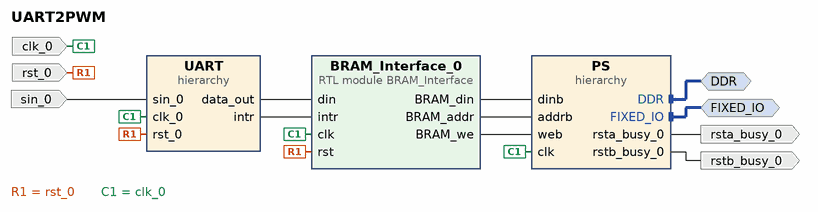
[diagram p0: block diagram of the top level]
# Vivado block design UART2PWM, xc7z020clg400-1, Vivado 2020.2
create_bd_design UART2PWM

create_bd_intf_port -mode Master -vlnv xilinx.com:interface:ddrx_rtl:1.0 DDR
create_bd_intf_port -mode Master -vlnv xilinx.com:display_processing_system7:fixedio_rtl:1.0 FIXED_IO
create_bd_port -dir I -type clk clk_0
set_property -dict {CONFIG.FREQ_HZ 125000000} [get_bd_ports clk_0]
create_bd_port -dir I rst_0
create_bd_port -dir I sin_0
create_bd_port -dir O rsta_busy_0
create_bd_port -dir O rstb_busy_0

create_bd_cell -type hier PS
create_bd_cell -type hier UART
create_bd_cell -type module -reference BRAM_Interface BRAM_Interface_0

# ---- hierarchy /PS ----
current_bd_instance /PS
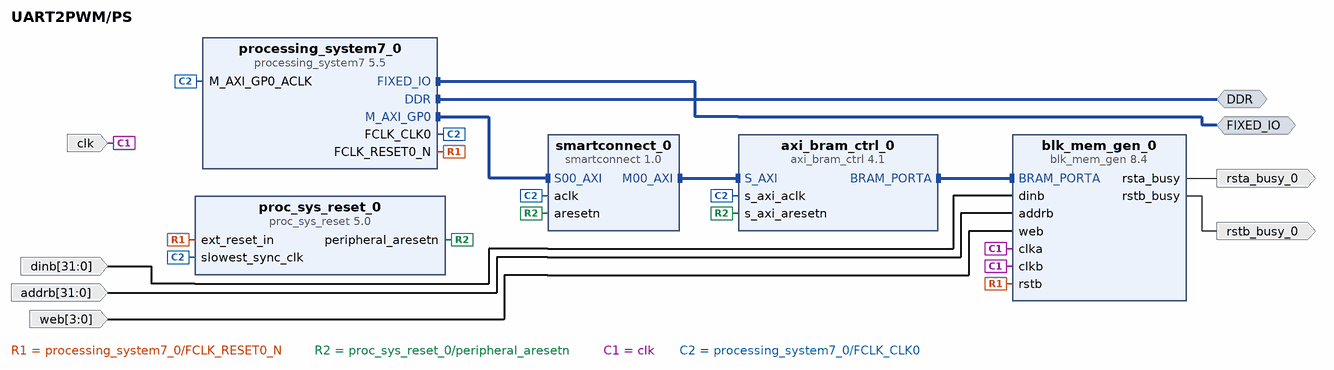
[diagram p1: block diagram inside /PS]
create_bd_intf_pin -mode Master -vlnv xilinx.com:interface:ddrx_rtl:1.0 DDR
create_bd_intf_pin -mode Master -vlnv xilinx.com:display_processing_system7:fixedio_rtl:1.0 FIXED_IO
create_bd_pin -dir O rsta_busy_0
create_bd_pin -dir O rstb_busy_0
create_bd_pin -dir I -from 31 -to 0 dinb
create_bd_pin -dir I clk
create_bd_pin -dir I -from 31 -to 0 addrb
create_bd_pin -dir I -from 3 -to 0 web

create_bd_cell -type ip -vlnv xilinx.com:ip:proc_sys_reset:5.0 proc_sys_reset_0
create_bd_cell -type ip -vlnv xilinx.com:ip:axi_bram_ctrl:4.1 axi_bram_ctrl_0
set_property -dict {CONFIG.SINGLE_PORT_BRAM 1} [get_bd_cells axi_bram_ctrl_0]
create_bd_cell -type ip -vlnv xilinx.com:ip:blk_mem_gen:8.4 blk_mem_gen_0
set_property -dict [list \
  CONFIG.Enable_B Use_ENB_Pin \
  CONFIG.Memory_Type True_Dual_Port_RAM \
  CONFIG.Port_B_Clock 100 \
  CONFIG.Port_B_Enable_Rate 100 \
  CONFIG.Port_B_Write_Rate 50 \
  CONFIG.Use_RSTB_Pin true \
] [get_bd_cells blk_mem_gen_0]
create_bd_cell -type ip -vlnv xilinx.com:ip:smartconnect:1.0 smartconnect_0
set_property -dict {CONFIG.NUM_SI 1} [get_bd_cells smartconnect_0]
create_bd_cell -type ip -vlnv xilinx.com:ip:processing_system7:5.5 processing_system7_0
set_property -dict [list \
  CONFIG.PCW_APU_PERIPHERAL_FREQMHZ 650 \
  CONFIG.PCW_CRYSTAL_PERIPHERAL_FREQMHZ 50 \
  CONFIG.PCW_ENET0_ENET0_IO {MIO 16 .. 27} \
  CONFIG.PCW_ENET0_GRP_MDIO_ENABLE 1 \
  CONFIG.PCW_ENET0_GRP_MDIO_IO {MIO 52 .. 53} \
  CONFIG.PCW_ENET0_PERIPHERAL_ENABLE 1 \
  CONFIG.PCW_ENET0_RESET_ENABLE 1 \
  CONFIG.PCW_ENET0_RESET_IO {MIO 9} \
  CONFIG.PCW_ENET_RESET_ENABLE 1 \
  CONFIG.PCW_ENET_RESET_SELECT {Share reset pin} \
  CONFIG.PCW_FPGA0_PERIPHERAL_FREQMHZ 100 \
  CONFIG.PCW_FPGA1_PERIPHERAL_FREQMHZ 50 \
  CONFIG.PCW_GPIO_MIO_GPIO_ENABLE 1 \
  CONFIG.PCW_GPIO_MIO_GPIO_IO MIO \
  CONFIG.PCW_I2C_RESET_ENABLE 1 \
  CONFIG.PCW_M_AXI_GP0_FREQMHZ 10 \
  CONFIG.PCW_PERIPHERAL_BOARD_PRESET None \
  CONFIG.PCW_PRESET_BANK1_VOLTAGE {LVCMOS 1.8V} \
  CONFIG.PCW_QSPI_GRP_FBCLK_ENABLE 1 \
  CONFIG.PCW_QSPI_GRP_FBCLK_IO {MIO 8} \
  CONFIG.PCW_QSPI_GRP_SINGLE_SS_ENABLE 1 \
  CONFIG.PCW_QSPI_GRP_SINGLE_SS_IO {MIO 1 .. 6} \
  CONFIG.PCW_QSPI_PERIPHERAL_ENABLE 1 \
  CONFIG.PCW_QSPI_QSPI_IO {MIO 1 .. 6} \
  CONFIG.PCW_SD0_GRP_CD_ENABLE 1 \
  CONFIG.PCW_SD0_GRP_CD_IO {MIO 47} \
  CONFIG.PCW_SD0_GRP_WP_ENABLE 0 \
  CONFIG.PCW_SD0_PERIPHERAL_ENABLE 1 \
  CONFIG.PCW_SD0_SD0_IO {MIO 40 .. 45} \
  CONFIG.PCW_SDIO_PERIPHERAL_FREQMHZ 50 \
  CONFIG.PCW_SINGLE_QSPI_DATA_MODE x4 \
  CONFIG.PCW_UART0_PERIPHERAL_ENABLE 1 \
  CONFIG.PCW_UART0_UART0_IO {MIO 14 .. 15} \
  CONFIG.PCW_UART1_PERIPHERAL_ENABLE 0 \
  CONFIG.PCW_UART_PERIPHERAL_FREQMHZ 100 \
  CONFIG.PCW_UIPARAM_DDR_BUS_WIDTH {16 Bit} \
  CONFIG.PCW_UIPARAM_DDR_FREQ_MHZ 525 \
  CONFIG.PCW_UIPARAM_DDR_PARTNO {MT41J256M16 RE-125} \
  CONFIG.PCW_USB0_PERIPHERAL_ENABLE 1 \
  CONFIG.PCW_USB0_RESET_ENABLE 1 \
  CONFIG.PCW_USB0_RESET_IO {MIO 46} \
  CONFIG.PCW_USB0_USB0_IO {MIO 28 .. 39} \
  CONFIG.PCW_USB_RESET_ENABLE 1 \
  CONFIG.PCW_USB_RESET_SELECT {Share reset pin} \
] [get_bd_cells processing_system7_0]
# 481 more settings of processing_system7_0 are not shown: defaults, MIO pin electricals, DDR timing, and values the tool derives

# ---- hierarchy /UART ----
current_bd_instance /UART
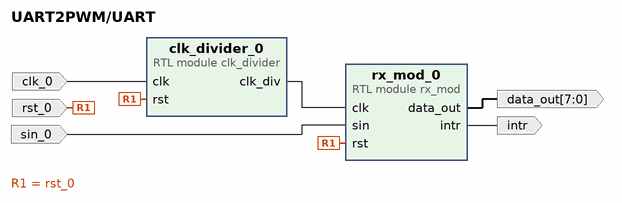
[diagram p2: block diagram inside /UART]
create_bd_pin -dir I -type clk clk_0
create_bd_pin -dir I rst_0
create_bd_pin -dir I sin_0
create_bd_pin -dir O -from 7 -to 0 data_out
create_bd_pin -dir O -type intr intr

create_bd_cell -type module -reference clk_divider clk_divider_0
create_bd_cell -type module -reference rx_mod rx_mod_0

# ---- connections ----

current_bd_instance /PS
connect_bd_intf_net [get_bd_intf_pins axi_bram_ctrl_0/BRAM_PORTA] [get_bd_intf_pins blk_mem_gen_0/BRAM_PORTA]
connect_bd_intf_net [get_bd_intf_pins axi_bram_ctrl_0/S_AXI] [get_bd_intf_pins smartconnect_0/M00_AXI]
connect_bd_intf_net [get_bd_intf_pins FIXED_IO] [get_bd_intf_pins processing_system7_0/FIXED_IO]
connect_bd_intf_net [get_bd_intf_pins DDR] [get_bd_intf_pins processing_system7_0/DDR]
connect_bd_intf_net [get_bd_intf_pins processing_system7_0/M_AXI_GP0] [get_bd_intf_pins smartconnect_0/S00_AXI]
connect_bd_net [get_bd_pins processing_system7_0/FCLK_RESET0_N] [get_bd_pins proc_sys_reset_0/ext_reset_in] [get_bd_pins blk_mem_gen_0/rstb]
connect_bd_net [get_bd_pins proc_sys_reset_0/peripheral_aresetn] [get_bd_pins axi_bram_ctrl_0/s_axi_aresetn] [get_bd_pins smartconnect_0/aresetn]
connect_bd_net [get_bd_pins blk_mem_gen_0/rsta_busy] [get_bd_pins rsta_busy_0]
connect_bd_net [get_bd_pins blk_mem_gen_0/rstb_busy] [get_bd_pins rstb_busy_0]
connect_bd_net [get_bd_pins dinb] [get_bd_pins blk_mem_gen_0/dinb]
connect_bd_net [get_bd_pins clk] [get_bd_pins blk_mem_gen_0/clka] [get_bd_pins blk_mem_gen_0/clkb]
connect_bd_net [get_bd_pins addrb] [get_bd_pins blk_mem_gen_0/addrb]
connect_bd_net [get_bd_pins web] [get_bd_pins blk_mem_gen_0/web]
connect_bd_net [get_bd_pins processing_system7_0/FCLK_CLK0] \
  [get_bd_pins processing_system7_0/M_AXI_GP0_ACLK] [get_bd_pins proc_sys_reset_0/slowest_sync_clk] \
  [get_bd_pins axi_bram_ctrl_0/s_axi_aclk] [get_bd_pins smartconnect_0/aclk]
set_property HDL_ATTRIBUTE.BMM_INFO_ADDRESS_SPACE {byte  0x40000000 32 > UART2PWM BRAM/blk_mem_gen_0} [get_bd_cells axi_bram_ctrl_0]
set_property HDL_ATTRIBUTE.KEEP_HIERARCHY yes [get_bd_cells axi_bram_ctrl_0]
set_property HDL_ATTRIBUTE.BMM_INFO_PROCESSOR {arm > UART2PWM BRAM/axi_bram_ctrl_0} [get_bd_cells processing_system7_0]
set_property HDL_ATTRIBUTE.KEEP_HIERARCHY yes [get_bd_cells processing_system7_0]

current_bd_instance /UART
connect_bd_net [get_bd_pins clk_divider_0/clk_div] [get_bd_pins rx_mod_0/clk]
connect_bd_net -net clk_0_1 [get_bd_pins clk_0] [get_bd_pins clk_divider_0/clk]
connect_bd_net -net rst_0_1 [get_bd_pins rst_0] [get_bd_pins rx_mod_0/rst] [get_bd_pins clk_divider_0/rst]
connect_bd_net [get_bd_pins sin_0] [get_bd_pins rx_mod_0/sin]
connect_bd_net [get_bd_pins rx_mod_0/data_out] [get_bd_pins data_out]
connect_bd_net [get_bd_pins rx_mod_0/intr] [get_bd_pins intr]

current_bd_instance /
connect_bd_intf_net -intf_net BRAM_DDR [get_bd_intf_ports DDR] [get_bd_intf_pins PS/DDR]
connect_bd_intf_net -intf_net BRAM_FIXED_IO [get_bd_intf_ports FIXED_IO] [get_bd_intf_pins PS/FIXED_IO]
connect_bd_net -net BRAM_rsta_busy_0 [get_bd_pins PS/rsta_busy_0] [get_bd_ports rsta_busy_0]
connect_bd_net -net BRAM_rstb_busy_0 [get_bd_pins PS/rstb_busy_0] [get_bd_ports rstb_busy_0]
connect_bd_net [get_bd_ports sin_0] [get_bd_pins UART/sin_0]
connect_bd_net -net rst_0_1 [get_bd_ports rst_0] [get_bd_pins UART/rst_0] [get_bd_pins BRAM_Interface_0/rst]
connect_bd_net -net clk_0_1 [get_bd_ports clk_0] [get_bd_pins UART/clk_0] [get_bd_pins PS/clk] [get_bd_pins BRAM_Interface_0/clk]
connect_bd_net [get_bd_pins UART/data_out] [get_bd_pins BRAM_Interface_0/din]
connect_bd_net [get_bd_pins UART/intr] [get_bd_pins BRAM_Interface_0/intr]
connect_bd_net [get_bd_pins BRAM_Interface_0/BRAM_din] [get_bd_pins PS/dinb]
connect_bd_net [get_bd_pins BRAM_Interface_0/BRAM_addr] [get_bd_pins PS/addrb]
connect_bd_net [get_bd_pins BRAM_Interface_0/BRAM_we] [get_bd_pins PS/web]

# ---- address map ----
assign_bd_address -offset 0x40000000 -range 8K -target_address_space [get_bd_addr_spaces PS/processing_system7_0/Data] [get_bd_addr_segs PS/axi_bram_ctrl_0/S_AXI/Mem0]

validate_bd_design
save_bd_design
